# EAGLE design DAQ Module (EAGLE 9.5.1)
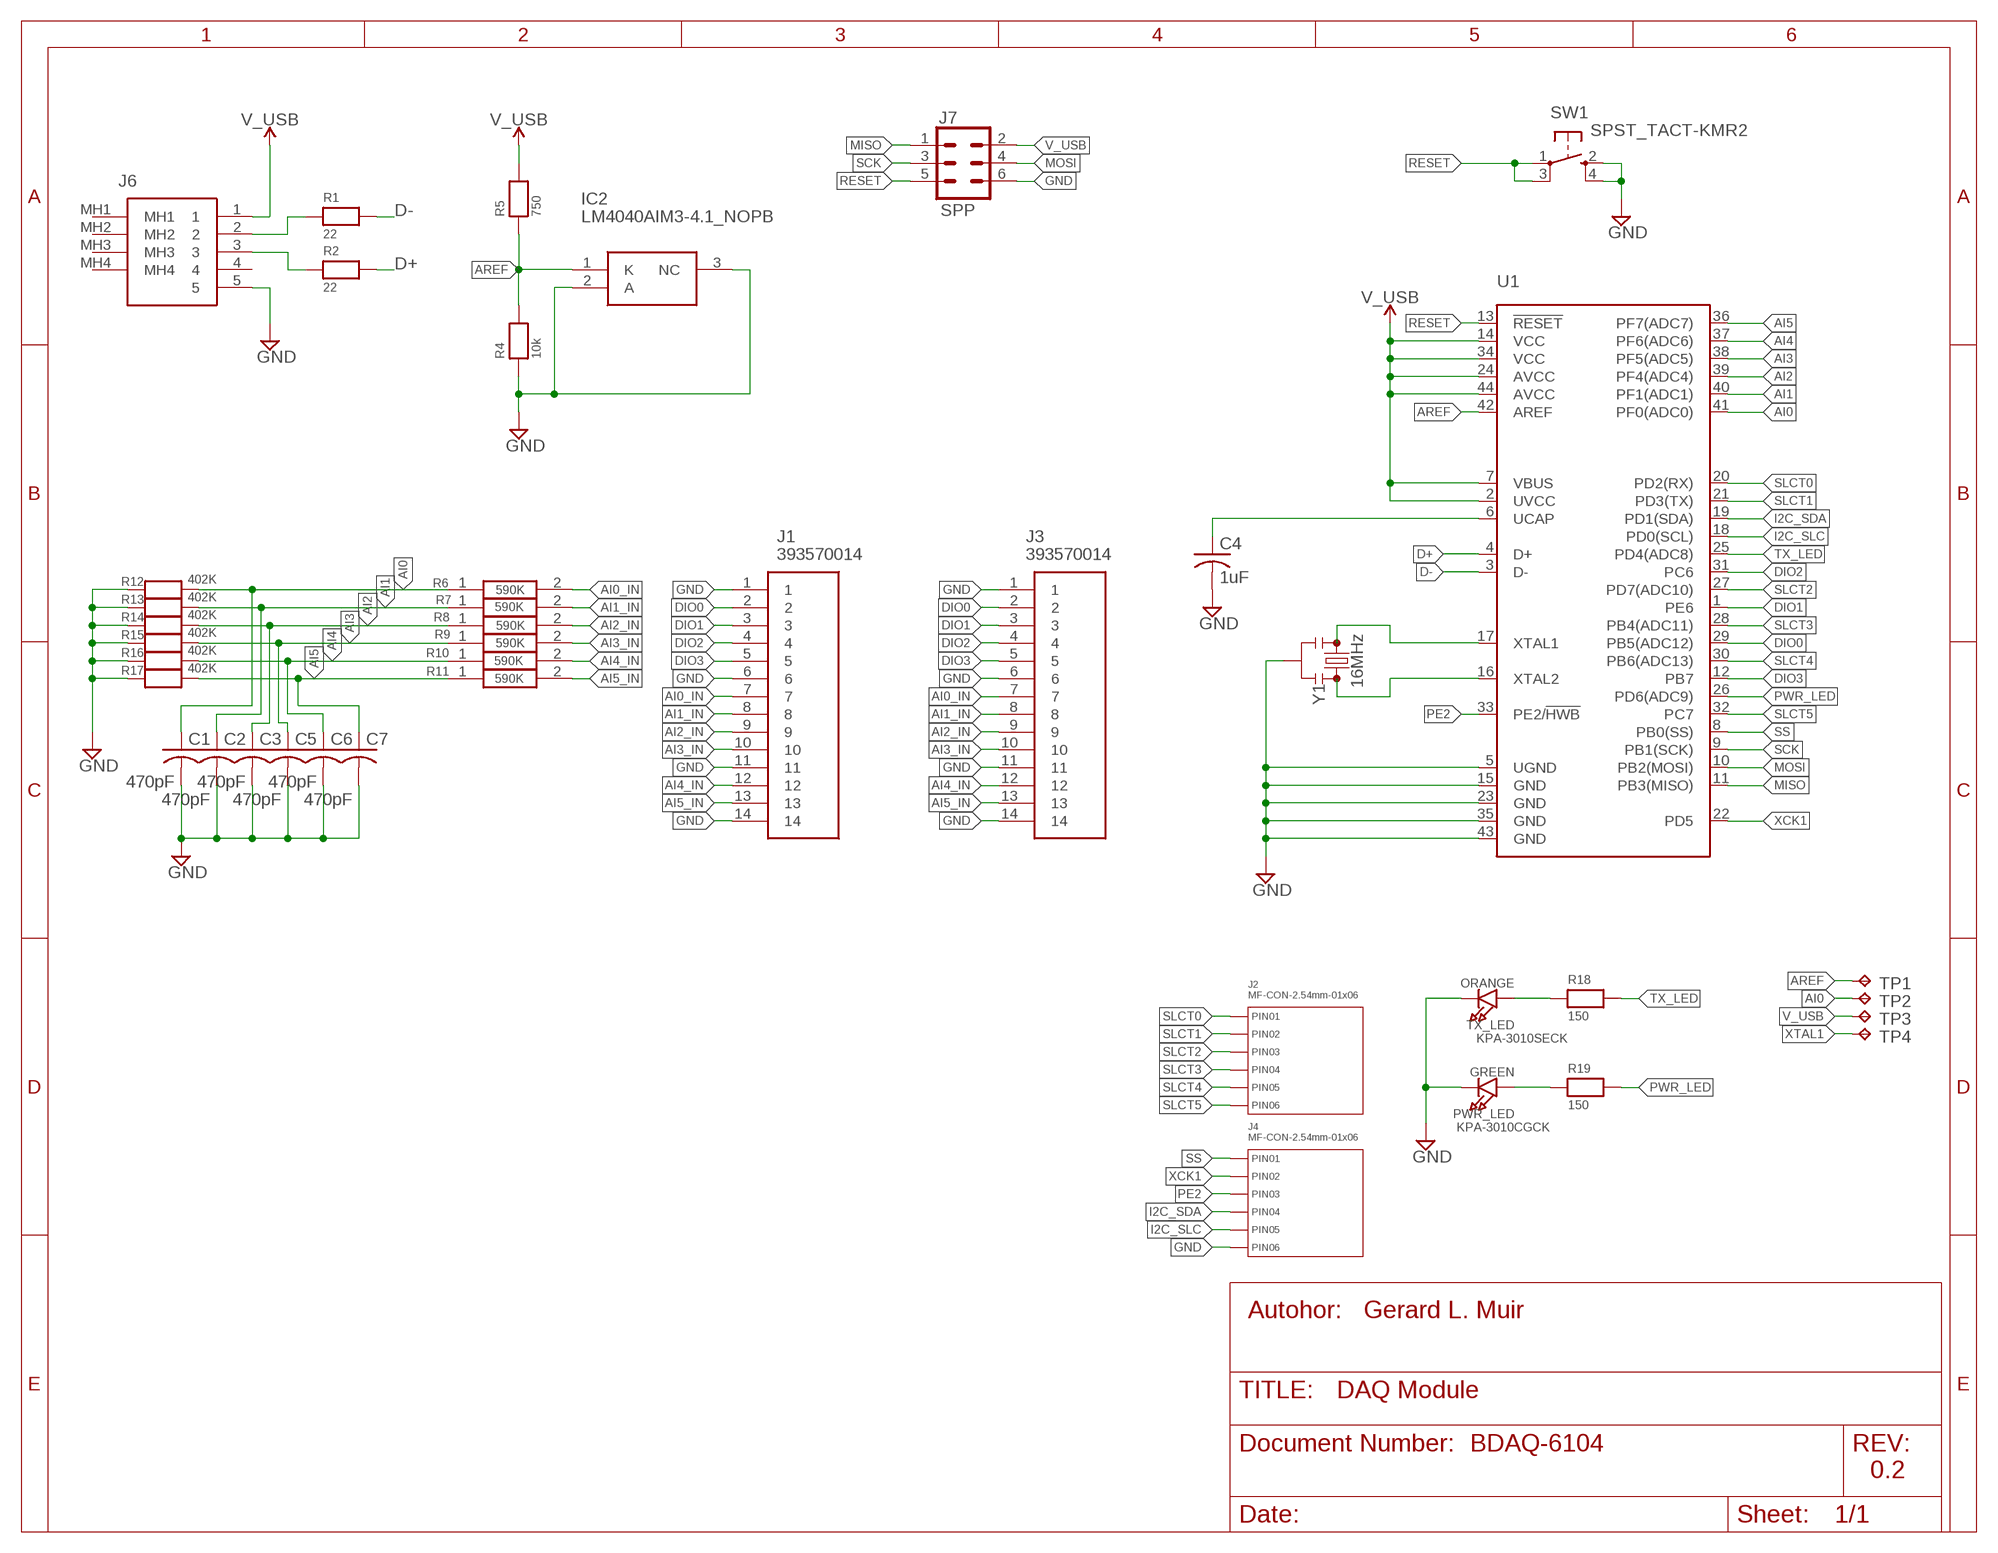
[diagram p0: schematic, sheet 1]

## Parts
C1  470pF  C-USC1206  [C1206]
C2  470pF  C-USC1206  [C1206]
C3  470pF  C-USC1206  [C1206]
C4  1uF  C-USC1206  [C1206]
C5  470pF  C-USC1206  [C1206]
C6  470pF  C-USC1206  [C1206]
C7  470pF  C-USC1206  [C1206]
IC2  LM4040AIM3-4.1_NOPB  [SOT95P237X112-3N]
J1  393570014  [RHDR16W90P0X350_1X14_5600X729X]
J2  MF-CON-2.54mm-01x06  CON_01X06_PTH_2.54MM  [PTH_2.54MM_01X06]
J3  393570014  [393570014X350_1X14]
J4  MF-CON-2.54mm-01x06  CON_01X06_PTH_2.54MM  [PTH_2.54MM_01X06]
J6  UJ2-MIBH2-4-SMT-TR  [UJ2MIBH24SMTTR]
J7  SPP  CONN_03X2FEMALE  [2X3]
PWR_LED  GREEN  LED1206  [CHIPLED_1206]
R1  22  RESISTOR1206  [1206]
R2  22  RESISTOR1206  [1206]
R4  10k  RESISTOR1206  [1206]
R5  750  RESISTOR1206  [1206]
R6  590K  ERJ3RED5903V  [RESC1608X55N]
R7  590K  ERJ3RED5903V  [RESC1608X55N]
R8  590K  ERJ3RED5903V  [RESC1608X55N]
R9  590K  ERJ3RED5903V  [RESC1608X55N]
R10  590K  ERJ3RED5903V  [RESC1608X55N]
R11  590K  ERJ3RED5903V  [RESC1608X55N]
R12  402K  RESISTOR1206  [1206]
R13  402K  RESISTOR1206  [1206]
R14  402K  RESISTOR1206  [1206]
R15  402K  RESISTOR1206  [1206]
R16  402K  RESISTOR1206  [1206]
R17  402K  RESISTOR1206  [1206]
R18  150  RESISTOR1206  [1206]
R19  150  RESISTOR1206  [1206]
SW1  SPST_TACT-KMR2  [KMR2]
TP1  TPB1,27  [B1,27]
TP2  TPB1,27  [B1,27]
TP3  TPB1,27  [B1,27]
TP4  TPB1,27  [B1,27]
TX_LED  ORANGE  LED1206  [CHIPLED_1206]
U1  ATMEGA32U4TQFP  [SPARKFUN-DIGITALIC_TQFP44]
Y1  16MHz  RESONATOR-16MHZSMD_3.2X1.3  [RESONATOR-SMD-3.2X1.3]

## Nets
AI0: C1.1 R6.1 R12.2 TP2.TP U1.41(PF0(ADC0))
AI0_IN: J1.7 J3.7 R6.2
AI1: C2.1 R7.1 R13.2 U1.40(PF1(ADC1))
AI1_IN: J1.8 J3.8 R7.2
AI2: C3.1 R8.1 R14.2 U1.39(PF4(ADC4))
AI2_IN: J1.9 J3.9 R8.2
AI3: C5.1 R9.1 R15.2 U1.38(PF5(ADC5))
AI3_IN: J1.10 J3.10 R9.2
AI4: C6.1 R10.1 R16.2 U1.37(PF6(ADC6))
AI4_IN: J1.12 J3.12 R10.2
AI5: C7.1 R11.1 R17.2 U1.36(PF7(ADC7))
AI5_IN: J1.13 J3.13 R11.2
AREF: IC2.1(K) R4.2 R5.1 TP1.TP U1.42(AREF)
D+: R2.2 U1.4(D+)
D-: R1.2 U1.3(D-)
DIO0: J1.2 J3.2 U1.29(PB5(ADC12))
DIO1: J1.3 J3.3 U1.1(PE6)
DIO2: J1.4 J3.4 U1.31(PC6)
DIO3: J1.5 J3.5 U1.12(PB7)
GND: C1.2 C2.2 C3.2 C4.2 C5.2 C6.2 C7.2 IC2.2(A) IC2.3(NC) J1.1 J1.6 J1.11 J1.14 J3.1 J3.6 J3.11 J3.14 J4.P$6(PIN6) J6.5 J7.6 PWR_LED.C R4.1 R12.1 R13.1 R14.1 R15.1 R16.1 R17.1 SW1.2(S) SW1.4(S1) TX_LED.C U1.5(UGND) U1.15(GND) U1.23(GND) U1.35(GND) U1.43(GND) Y1.2
I2C_SDA: J4.P$4(PIN4) U1.19(PD1(SDA))
I2C_SLC: J4.P$5(PIN5) U1.18(PD0(SCL))
MISO: J7.1 U1.11(PB3(MISO))
MOSI: J7.4 U1.10(PB2(MOSI))
N$2: J6.2 R1.1
N$5: J6.3 R2.1
N$7: C4.1 U1.6(UCAP)
N$8: R18.1 TX_LED.A
N$9: PWR_LED.A R19.1
PE2: J4.P$3(PIN3) U1.33(PE2/!HWB)
PWR_LED: R19.2 U1.26(PD6(ADC9))
RESET: J7.5 SW1.1(P) SW1.3(P1) U1.13(!RESET)
SCK: J7.3 U1.9(PB1(SCK))
SLCT0: J2.P$1(PIN1) U1.20(PD2(RX))
SLCT1: J2.P$2(PIN2) U1.21(PD3(TX))
SLCT2: J2.P$3(PIN3) U1.27(PD7(ADC10))
SLCT3: J2.P$4(PIN4) U1.28(PB4(ADC11))
SLCT4: J2.P$5(PIN5) U1.30(PB6(ADC13))
SLCT5: J2.P$6(PIN6) U1.32(PC7)
SS: J4.P$1(PIN1) U1.8(PB0(SS))
TX_LED: R18.2 U1.25(PD4(ADC8))
V_USB: J6.1 J7.2 R5.2 TP3.TP U1.2(UVCC) U1.7(VBUS) U1.14(VCC) U1.24(AVCC) U1.34(VCC) U1.44(AVCC)
XCK1: J4.P$2(PIN2) U1.22(PD5)
XTAL1: TP4.TP U1.17(XTAL1) Y1.3
XTAL2: U1.16(XTAL2) Y1.1
Unconnected: J6.4 J6.MH1 J6.MH2 J6.MH3 J6.MH4

## Notes on the sheet
- Autohor: | Gerard L. Muir
- BDAQ-6104
- 0.2

## Library data of the parts
C1-C3 C5-C7 = adafruit:C-US: CAPACITOR, American symbol; MANUFACTURER_NAME: KEMET; MANUFACTURER_PART: C1206C471J5GACTU; SUPPLIER: Newark; SUPPLIER_PART: 50AC8485
C4 = adafruit:C-US: CAPACITOR, American symbol; MANUFACTURER_NAME: TDK; MANUFACTURER_PART: C3216X7R1E105K085AACopied; SUPPLIER: NEWARK; SUPPLIER_PART: 90R7794
IC2 = LM4040AIM3-4.1_NOPB:LM4040AIM3-4.1_NOPB: 100-ppm/C precision micropower shunt voltage reference Source: Datasheet <https://datasheet.datasheetarchive.com/originals/distributors/Datasheets-DGA16/867642.pdf>; ARROW_PART_NUMBER: LM4040AIM3-4.1/NOPB; ARROW_PRICE-STOCK: https://www.arrow.com/en/products/lm4040aim3-4.1nopb/texas-instruments?region=nac; DESCRIPTION: 100-ppm/C precision micropower shunt voltage reference; HEIGHT: 1.12mm; MANUFACTURER_NAME: Texas Instruments; MANUFACTURER_PART_NUMBER: LM4040AIM3-4.1/NOPB; MOUSER_PART_NUMBER: 926-LM4040AIM341NOPB; MOUSER_PRICE-STOCK: https://www.mouser.co.uk/ProductDetail/Texas-Instruments/LM4040AIM3-4.1-NOPB?qs=QbsRYf82W3H1qYso%252BTC8AA%3D%3D
J1 = 393570014:393570014: 3.50mm Pitch Beau Eurostyle Fixed Mount PCB Terminal Block, Circuits Source: Datasheet <https://www.molex.com/pdm_docs/sd/393570005_sd.pdf>; DESCRIPTION: 3.50mm Pitch Beau Eurostyle Fixed Mount PCB Terminal Block, Circuits; HEIGHT: 8.51mm; MANUFACTURER_NAME: Molex; MANUFACTURER_PART_NUMBER: 393570016
J2 J4 = MF_Connectors:CON_01X06: Library: MF_Connectors Description: Header Connector with 6 Positions and 01 Rows. Use the LABEL Attribute to label the pin on the schematic and PCB. You can remove the attributes on the PCB by using the SMASH function on the part and then deleting the text.; HOUSEPART: YES; MPN: MF-CON-2.54mm-01x06; POPULATE: 1; URL: https://factory.macrofab.com/part/MF-CON-2.54mm-01x06
J3 = 3950666014:393570014: 3.50mm Pitch Beau Eurostyle Fixed Mount PCB Terminal Block, Circuits Source: Datasheet <https://www.molex.com/pdm_docs/sd/393570005_sd.pdf>; DESCRIPTION: 3.50mm Pitch Beau Eurostyle Fixed Mount PCB Terminal Block, Circuits; HEIGHT: 8.51mm; MANUFACTURER_NAME: Molex; MANUFACTURER_PART_NUMBER: 393570016
J6 = UJ2-MIBH2-4-SMT-TR:UJ2-MIBH2-4-SMT-TR: CONN RCPT USB2.0 MICRO B SMD R/A Source: Datasheet <https://www.cui.com/product/resource/digikeypdf/uj2-mibh2-4-smt.pdf>; ARROW_PART_NUMBER: UJ2-MIBH2-4-SMT-TR; ARROW_PRICE-STOCK: https://www.arrow.com/en/products/uj2-mibh2-4-smt-tr/cui-devices?utm_currency=USD&region=nac; DESCRIPTION: CONN RCPT USB2.0 MICRO B SMD R/A; HEIGHT: 2.5mm; MANUFACTURER_NAME: Same Sky; MANUFACTURER_PART_NUMBER: UJ2-MIBH2-4-SMT-TR; MOUSER_PART_NUMBER: 490-UJ2-MIBH2-4-SMT; MOUSER_PRICE-STOCK: https://www.mouser.co.uk/ProductDetail/Same-Sky/UJ2-MIBH2-4-SMT-TR?qs=5mqXD9RfOg1yxHIpPvPxvQ%3D%3D
J7 = SparkFun-Connectors:CONN_03X2: Multi connection point. Often used as Generic Header-pin footprint for 0.1 inch spaced/style header connections You can populate with any combo of single row headers, but if you'd like an exact match, check these: Header - 2x3 (Male, 0.1") <https://www.sparkfun.com/products/12807> (PRT-12807) Header - 2x3 (Female, 0.1") <https://www.sparkfun.com/products/13010> (PRT-13010) 2x3 Pin Shrouded Header <https://www.sparkfun.com/products/10877> (PRT-10877) On any of the 0.1 inch spaced packages, you can populate with these: Break Away Headers - Straight <https://www.sparkfun.com/products/116> (PRT-00116) Break Away Male Headers - Right Angle <https://www.sparkfun.com/products/553> (PRT-00553) Female Headers <https://www.sparkfun.com/products/115> (PRT-00115) Break Away Headers - Machine Pin <https://www.sparkfun.com/products/117> (PRT-00117) Break Away Female Headers - Swiss Machine Pin <https://www.sparkfun.com/products/743> (PRT-00743) Special note: the shrouded connector mates well with our 3x2 ribbon cables: Ribbon Crimp Connector - 6-pin (2x3, Female) <https://www.sparkfun.com/products/10651> (PRT-10651) Ribbon Cable - 6 wire (15ft) <https://www.sparkfun.com/products/10646> (PRT-10646); PROD_ID: CONN-11566; VALUE: FEMALE 2x3
PWR_LED = microbuilder:LED: LED 0603 - 0603 Surface Mount Package 2mA: Green LED - Low Power (3.9mcd, 2ma, 1.7Vf) - Digikey: 475-2709-2-ND Orange LED - Low Power (9.8mcd, 2ma, 1.8Vf) - Digikey: 475-1194-2-ND Red LED - Low Power (5mcd, 2ma, 1.8Vf) - Digikey: 475-1195-2-ND Yellow LED - Low Power (7mcd, 2ma, 1.8Vf) - Digikey: 475-1196-2-ND 5mA: Blue LED - Low Power (17mcd, 5ma, 2.9Vf) - Digikey: LNJ937W8CRACT-ND 0805 - 0805 Surface Mount Package 2mA: Red LED (8.8mcd, 2mA, 1.8Vf, Clear) - Low Power [Digikey: 475-2510-1-ND] Green LED (5mcd, 2mA, 1.8Vf, Clear) - Low Power [Digikey: 475-2730-1-ND] Yellow LED (11.3mcd, 2mA, 1.8Vf, Clear) - Low Power [Digikey: 475-2555-1-ND] 20mA: Red LED (104mcd, 20mA, Diffused) - LS R976 [Digikey: 475-1278-6-ND] Red LED (12mcd, 20mA, 2.0Vf, Clear) - APT2012EC [Digikey: 754-1128-1-ND] Green LED (15mcd, 20mA, 2.2Vf, Clear) - APT2012GC [Digikey: 754-1131-1-ND] Orange LED (160mcd, 20mA, 2.1Vf, Clear) - APT2012SECK [Digikey: 754-1130-1-ND] 1206 - 1206 Surface Mount Package Green LED (26mcd, 20mA, Diffused) - LG N971 [Digikey: 475-1407-6-ND] Red LED (15mcd, 20mA, Diffused) - LH N974 [Digikey: 475-1416-6-ND]; MANUFACTURER_NAME: KINGBRIGHT; MANUFACTURER_PART: KPA-3010CGCK; SUPPLIER: Newark; SUPPLIER_PART: 28W1828
R1 = microbuilder:RESISTOR: Resistors 0402 - 0402 Surface Mount Package 22 Ohm 1% 1/16W [Digikey: 311-22.0LRTR-ND] 33 Ohm 5% 1/16W 1.0K 5% 1/16W 1.5K 5% 1/16W 2.0K 1% 1/16W 10.0K 1% 1/16W [Digikey: 311-10.0KLRTR-ND] 10.0K 5% 1/16W [Digikey: RMCF0402JT10K0TR-ND] 12.1K 1% 1/16W [Digikey: 311-22.0LRTR-ND] 100.0K 5% 1/16W 0603 - 0603 Surface Mount Package 0 Ohm 1/10 Watt 1% Resistor 15 Ohm 1/10 Watt 1% Resistor 33 Ohm 1/10 Watt 1% Resistor 49.9 Ohm 1/10 Watt 1% Resistor 100 Ohm 1/10 Watt 1% Resistor 150 Ohm 1/10 Watt 1% Resistor 240 Ohm 1/10 Watt 1% Resistor 390 Ohm 1/10 Watt 1% Resistor 560 Ohm 1/10 Watt 1% Resistor 680 Ohm 1/10 Watt 1% Resistor 750 Ohm 1/10 Watt 1% Resistor 1.0K Ohm 1/10 Watt 1% Resistor 1.5K Ohm 1/10 Watt 1% Resistor 2.0K Ohm 1/10 Watt 1% Resistor 2.2K Ohm 1/10 Watt 1% Resistor 3.3K Ohm 1/10 Watt 1% Resistor 4.7K Ohm 1/10 Watt 1% Resistor 10.0K Ohm 1/10 Watt 1% Resistor 12.0K Ohm 1/10 Watt 1% Resistor 12.1K Ohm 1/10 Watt 1% Resistor 20.0K Ohm 1/10 Watt 1% Resistor 33.0K Ohm 1/10 Watt 1% Resistor 100.0K Ohm 1/10 Watt 1% Resistor 0805 - 0805 Surface Mount Package 0 Ohm 1/8 Watt 1% Resistor 33 Ohm 1/8 Watt 1% Resistor 100 Ohm 1/8 Watt 1% Resistor 150 Ohm 1/8 Watt 1% Resistor 200 Ohm 1/8 Watt 1% Resistor 240 Ohm 1/8 Watt 1% Resistor 330 Ohm 1/8 Watt 1% Resistor 390 Ohm 1/8 Watt 1% Resistor 470 Ohm 1/8 Watt 1% Resistor 1.0K Ohm 1/8 Watt 1% Resistor 1.5K Ohm 1/8 Watt 1% Resistor 2.0K Ohm 1/8 Watt 1% Resistor 4.7K Ohm 1/8 Watt 1% Resistor 5.1K Ohm 1/8 Watt 1% Resistor 5.6K Ohm 1/8 Watt 1% Resistor 10.0K Ohm 1/8 Watt 1% Resistor 22.0K Ohm 1/8 Watt 1% Resistor 33.0K Ohm 1/8 Watt 1% Resistor 100K Ohm 1/8 Watt 1% Resistor 1206 - 1206 Surface Mount Package 2012 - 2010 Surface Mount Package 0.11 Ohm 1/2 Watt 1% Resistor - Digikey: RHM.11UCT-ND; MANUFACTURER_NAME: PANASONIC; MANUFACTURER_PART: ERJ8ENF22R0V; SUPPLIER: NEWARK; SUPPLIER_PART: 64R5449
R2 R19 = microbuilder:RESISTOR: Resistors 0402 - 0402 Surface Mount Package 22 Ohm 1% 1/16W [Digikey: 311-22.0LRTR-ND] 33 Ohm 5% 1/16W 1.0K 5% 1/16W 1.5K 5% 1/16W 2.0K 1% 1/16W 10.0K 1% 1/16W [Digikey: 311-10.0KLRTR-ND] 10.0K 5% 1/16W [Digikey: RMCF0402JT10K0TR-ND] 12.1K 1% 1/16W [Digikey: 311-22.0LRTR-ND] 100.0K 5% 1/16W 0603 - 0603 Surface Mount Package 0 Ohm 1/10 Watt 1% Resistor 15 Ohm 1/10 Watt 1% Resistor 33 Ohm 1/10 Watt 1% Resistor 49.9 Ohm 1/10 Watt 1% Resistor 100 Ohm 1/10 Watt 1% Resistor 150 Ohm 1/10 Watt 1% Resistor 240 Ohm 1/10 Watt 1% Resistor 390 Ohm 1/10 Watt 1% Resistor 560 Ohm 1/10 Watt 1% Resistor 680 Ohm 1/10 Watt 1% Resistor 750 Ohm 1/10 Watt 1% Resistor 1.0K Ohm 1/10 Watt 1% Resistor 1.5K Ohm 1/10 Watt 1% Resistor 2.0K Ohm 1/10 Watt 1% Resistor 2.2K Ohm 1/10 Watt 1% Resistor 3.3K Ohm 1/10 Watt 1% Resistor 4.7K Ohm 1/10 Watt 1% Resistor 10.0K Ohm 1/10 Watt 1% Resistor 12.0K Ohm 1/10 Watt 1% Resistor 12.1K Ohm 1/10 Watt 1% Resistor 20.0K Ohm 1/10 Watt 1% Resistor 33.0K Ohm 1/10 Watt 1% Resistor 100.0K Ohm 1/10 Watt 1% Resistor 0805 - 0805 Surface Mount Package 0 Ohm 1/8 Watt 1% Resistor 33 Ohm 1/8 Watt 1% Resistor 100 Ohm 1/8 Watt 1% Resistor 150 Ohm 1/8 Watt 1% Resistor 200 Ohm 1/8 Watt 1% Resistor 240 Ohm 1/8 Watt 1% Resistor 330 Ohm 1/8 Watt 1% Resistor 390 Ohm 1/8 Watt 1% Resistor 470 Ohm 1/8 Watt 1% Resistor 1.0K Ohm 1/8 Watt 1% Resistor 1.5K Ohm 1/8 Watt 1% Resistor 2.0K Ohm 1/8 Watt 1% Resistor 4.7K Ohm 1/8 Watt 1% Resistor 5.1K Ohm 1/8 Watt 1% Resistor 5.6K Ohm 1/8 Watt 1% Resistor 10.0K Ohm 1/8 Watt 1% Resistor 22.0K Ohm 1/8 Watt 1% Resistor 33.0K Ohm 1/8 Watt 1% Resistor 100K Ohm 1/8 Watt 1% Resistor 1206 - 1206 Surface Mount Package 2012 - 2010 Surface Mount Package 0.11 Ohm 1/2 Watt 1% Resistor - Digikey: RHM.11UCT-ND
R4 = microbuilder:RESISTOR: Resistors 0402 - 0402 Surface Mount Package 22 Ohm 1% 1/16W [Digikey: 311-22.0LRTR-ND] 33 Ohm 5% 1/16W 1.0K 5% 1/16W 1.5K 5% 1/16W 2.0K 1% 1/16W 10.0K 1% 1/16W [Digikey: 311-10.0KLRTR-ND] 10.0K 5% 1/16W [Digikey: RMCF0402JT10K0TR-ND] 12.1K 1% 1/16W [Digikey: 311-22.0LRTR-ND] 100.0K 5% 1/16W 0603 - 0603 Surface Mount Package 0 Ohm 1/10 Watt 1% Resistor 15 Ohm 1/10 Watt 1% Resistor 33 Ohm 1/10 Watt 1% Resistor 49.9 Ohm 1/10 Watt 1% Resistor 100 Ohm 1/10 Watt 1% Resistor 150 Ohm 1/10 Watt 1% Resistor 240 Ohm 1/10 Watt 1% Resistor 390 Ohm 1/10 Watt 1% Resistor 560 Ohm 1/10 Watt 1% Resistor 680 Ohm 1/10 Watt 1% Resistor 750 Ohm 1/10 Watt 1% Resistor 1.0K Ohm 1/10 Watt 1% Resistor 1.5K Ohm 1/10 Watt 1% Resistor 2.0K Ohm 1/10 Watt 1% Resistor 2.2K Ohm 1/10 Watt 1% Resistor 3.3K Ohm 1/10 Watt 1% Resistor 4.7K Ohm 1/10 Watt 1% Resistor 10.0K Ohm 1/10 Watt 1% Resistor 12.0K Ohm 1/10 Watt 1% Resistor 12.1K Ohm 1/10 Watt 1% Resistor 20.0K Ohm 1/10 Watt 1% Resistor 33.0K Ohm 1/10 Watt 1% Resistor 100.0K Ohm 1/10 Watt 1% Resistor 0805 - 0805 Surface Mount Package 0 Ohm 1/8 Watt 1% Resistor 33 Ohm 1/8 Watt 1% Resistor 100 Ohm 1/8 Watt 1% Resistor 150 Ohm 1/8 Watt 1% Resistor 200 Ohm 1/8 Watt 1% Resistor 240 Ohm 1/8 Watt 1% Resistor 330 Ohm 1/8 Watt 1% Resistor 390 Ohm 1/8 Watt 1% Resistor 470 Ohm 1/8 Watt 1% Resistor 1.0K Ohm 1/8 Watt 1% Resistor 1.5K Ohm 1/8 Watt 1% Resistor 2.0K Ohm 1/8 Watt 1% Resistor 4.7K Ohm 1/8 Watt 1% Resistor 5.1K Ohm 1/8 Watt 1% Resistor 5.6K Ohm 1/8 Watt 1% Resistor 10.0K Ohm 1/8 Watt 1% Resistor 22.0K Ohm 1/8 Watt 1% Resistor 33.0K Ohm 1/8 Watt 1% Resistor 100K Ohm 1/8 Watt 1% Resistor 1206 - 1206 Surface Mount Package 2012 - 2010 Surface Mount Package 0.11 Ohm 1/2 Watt 1% Resistor - Digikey: RHM.11UCT-ND; MANUFACTURER_NAME: YAGEO; MANUFACTURER_PART: RP1206BRD075K1L; SUPPLIER: NEWARK
R5 = microbuilder:RESISTOR: Resistors 0402 - 0402 Surface Mount Package 22 Ohm 1% 1/16W [Digikey: 311-22.0LRTR-ND] 33 Ohm 5% 1/16W 1.0K 5% 1/16W 1.5K 5% 1/16W 2.0K 1% 1/16W 10.0K 1% 1/16W [Digikey: 311-10.0KLRTR-ND] 10.0K 5% 1/16W [Digikey: RMCF0402JT10K0TR-ND] 12.1K 1% 1/16W [Digikey: 311-22.0LRTR-ND] 100.0K 5% 1/16W 0603 - 0603 Surface Mount Package 0 Ohm 1/10 Watt 1% Resistor 15 Ohm 1/10 Watt 1% Resistor 33 Ohm 1/10 Watt 1% Resistor 49.9 Ohm 1/10 Watt 1% Resistor 100 Ohm 1/10 Watt 1% Resistor 150 Ohm 1/10 Watt 1% Resistor 240 Ohm 1/10 Watt 1% Resistor 390 Ohm 1/10 Watt 1% Resistor 560 Ohm 1/10 Watt 1% Resistor 680 Ohm 1/10 Watt 1% Resistor 750 Ohm 1/10 Watt 1% Resistor 1.0K Ohm 1/10 Watt 1% Resistor 1.5K Ohm 1/10 Watt 1% Resistor 2.0K Ohm 1/10 Watt 1% Resistor 2.2K Ohm 1/10 Watt 1% Resistor 3.3K Ohm 1/10 Watt 1% Resistor 4.7K Ohm 1/10 Watt 1% Resistor 10.0K Ohm 1/10 Watt 1% Resistor 12.0K Ohm 1/10 Watt 1% Resistor 12.1K Ohm 1/10 Watt 1% Resistor 20.0K Ohm 1/10 Watt 1% Resistor 33.0K Ohm 1/10 Watt 1% Resistor 100.0K Ohm 1/10 Watt 1% Resistor 0805 - 0805 Surface Mount Package 0 Ohm 1/8 Watt 1% Resistor 33 Ohm 1/8 Watt 1% Resistor 100 Ohm 1/8 Watt 1% Resistor 150 Ohm 1/8 Watt 1% Resistor 200 Ohm 1/8 Watt 1% Resistor 240 Ohm 1/8 Watt 1% Resistor 330 Ohm 1/8 Watt 1% Resistor 390 Ohm 1/8 Watt 1% Resistor 470 Ohm 1/8 Watt 1% Resistor 1.0K Ohm 1/8 Watt 1% Resistor 1.5K Ohm 1/8 Watt 1% Resistor 2.0K Ohm 1/8 Watt 1% Resistor 4.7K Ohm 1/8 Watt 1% Resistor 5.1K Ohm 1/8 Watt 1% Resistor 5.6K Ohm 1/8 Watt 1% Resistor 10.0K Ohm 1/8 Watt 1% Resistor 22.0K Ohm 1/8 Watt 1% Resistor 33.0K Ohm 1/8 Watt 1% Resistor 100K Ohm 1/8 Watt 1% Resistor 1206 - 1206 Surface Mount Package 2012 - 2010 Surface Mount Package 0.11 Ohm 1/2 Watt 1% Resistor - Digikey: RHM.11UCT-ND; MANUFACTURER_NAME: MULTICOMP PRO; MANUFACTURER_PART: MC009121; SUPPLIER: NEWARK; SUPPLIE_PART: 78AC9440
R6-R11 = ERJ3RED5903V:ERJ3RED5903V: PANASONIC - ERJ3RED5903V - SMD Chip Resistor, 0603 [1608 Metric], 590 kohm, ERJ3R Series, 50 V, Thick Film, 63 mW Source: Datasheet <http://docs-europe.electrocomponents.com/webdocs/13ba/0900766b813ba21b.pdf>; DESCRIPTION: PANASONIC - ERJ3RED5903V - SMD Chip Resistor, 0603 [1608 Metric], 590 kohm, ERJ3R Series, 50 V, Thick Film, 63 mW; HEIGHT: 0.55mm; MANUFACTURER_NAME: Stackpole Electronics Inc; MANUFACTURER_PART: RNCS1206BKE1M00; MANUFACTURER_PART_NUMBER: ERJ3RED5903V; SUPPLIER: NEWARK; SUPPLIER_PART: RNCS1206BKE1M00TR-ND
R12-R17 = microbuilder:RESISTOR: Resistors 0402 - 0402 Surface Mount Package 22 Ohm 1% 1/16W [Digikey: 311-22.0LRTR-ND] 33 Ohm 5% 1/16W 1.0K 5% 1/16W 1.5K 5% 1/16W 2.0K 1% 1/16W 10.0K 1% 1/16W [Digikey: 311-10.0KLRTR-ND] 10.0K 5% 1/16W [Digikey: RMCF0402JT10K0TR-ND] 12.1K 1% 1/16W [Digikey: 311-22.0LRTR-ND] 100.0K 5% 1/16W 0603 - 0603 Surface Mount Package 0 Ohm 1/10 Watt 1% Resistor 15 Ohm 1/10 Watt 1% Resistor 33 Ohm 1/10 Watt 1% Resistor 49.9 Ohm 1/10 Watt 1% Resistor 100 Ohm 1/10 Watt 1% Resistor 150 Ohm 1/10 Watt 1% Resistor 240 Ohm 1/10 Watt 1% Resistor 390 Ohm 1/10 Watt 1% Resistor 560 Ohm 1/10 Watt 1% Resistor 680 Ohm 1/10 Watt 1% Resistor 750 Ohm 1/10 Watt 1% Resistor 1.0K Ohm 1/10 Watt 1% Resistor 1.5K Ohm 1/10 Watt 1% Resistor 2.0K Ohm 1/10 Watt 1% Resistor 2.2K Ohm 1/10 Watt 1% Resistor 3.3K Ohm 1/10 Watt 1% Resistor 4.7K Ohm 1/10 Watt 1% Resistor 10.0K Ohm 1/10 Watt 1% Resistor 12.0K Ohm 1/10 Watt 1% Resistor 12.1K Ohm 1/10 Watt 1% Resistor 20.0K Ohm 1/10 Watt 1% Resistor 33.0K Ohm 1/10 Watt 1% Resistor 100.0K Ohm 1/10 Watt 1% Resistor 0805 - 0805 Surface Mount Package 0 Ohm 1/8 Watt 1% Resistor 33 Ohm 1/8 Watt 1% Resistor 100 Ohm 1/8 Watt 1% Resistor 150 Ohm 1/8 Watt 1% Resistor 200 Ohm 1/8 Watt 1% Resistor 240 Ohm 1/8 Watt 1% Resistor 330 Ohm 1/8 Watt 1% Resistor 390 Ohm 1/8 Watt 1% Resistor 470 Ohm 1/8 Watt 1% Resistor 1.0K Ohm 1/8 Watt 1% Resistor 1.5K Ohm 1/8 Watt 1% Resistor 2.0K Ohm 1/8 Watt 1% Resistor 4.7K Ohm 1/8 Watt 1% Resistor 5.1K Ohm 1/8 Watt 1% Resistor 5.6K Ohm 1/8 Watt 1% Resistor 10.0K Ohm 1/8 Watt 1% Resistor 22.0K Ohm 1/8 Watt 1% Resistor 33.0K Ohm 1/8 Watt 1% Resistor 100K Ohm 1/8 Watt 1% Resistor 1206 - 1206 Surface Mount Package 2012 - 2010 Surface Mount Package 0.11 Ohm 1/2 Watt 1% Resistor - Digikey: RHM.11UCT-ND; MANUFACTURER_NAME: MULTICOMP PRO; MANUFACTURER_PART: MCWF12R4023BTL; SUPPLIER: NEWARK; SUPPLIER_PART: 92AH9453
R18 = microbuilder:RESISTOR: Resistors 0402 - 0402 Surface Mount Package 22 Ohm 1% 1/16W [Digikey: 311-22.0LRTR-ND] 33 Ohm 5% 1/16W 1.0K 5% 1/16W 1.5K 5% 1/16W 2.0K 1% 1/16W 10.0K 1% 1/16W [Digikey: 311-10.0KLRTR-ND] 10.0K 5% 1/16W [Digikey: RMCF0402JT10K0TR-ND] 12.1K 1% 1/16W [Digikey: 311-22.0LRTR-ND] 100.0K 5% 1/16W 0603 - 0603 Surface Mount Package 0 Ohm 1/10 Watt 1% Resistor 15 Ohm 1/10 Watt 1% Resistor 33 Ohm 1/10 Watt 1% Resistor 49.9 Ohm 1/10 Watt 1% Resistor 100 Ohm 1/10 Watt 1% Resistor 150 Ohm 1/10 Watt 1% Resistor 240 Ohm 1/10 Watt 1% Resistor 390 Ohm 1/10 Watt 1% Resistor 560 Ohm 1/10 Watt 1% Resistor 680 Ohm 1/10 Watt 1% Resistor 750 Ohm 1/10 Watt 1% Resistor 1.0K Ohm 1/10 Watt 1% Resistor 1.5K Ohm 1/10 Watt 1% Resistor 2.0K Ohm 1/10 Watt 1% Resistor 2.2K Ohm 1/10 Watt 1% Resistor 3.3K Ohm 1/10 Watt 1% Resistor 4.7K Ohm 1/10 Watt 1% Resistor 10.0K Ohm 1/10 Watt 1% Resistor 12.0K Ohm 1/10 Watt 1% Resistor 12.1K Ohm 1/10 Watt 1% Resistor 20.0K Ohm 1/10 Watt 1% Resistor 33.0K Ohm 1/10 Watt 1% Resistor 100.0K Ohm 1/10 Watt 1% Resistor 0805 - 0805 Surface Mount Package 0 Ohm 1/8 Watt 1% Resistor 33 Ohm 1/8 Watt 1% Resistor 100 Ohm 1/8 Watt 1% Resistor 150 Ohm 1/8 Watt 1% Resistor 200 Ohm 1/8 Watt 1% Resistor 240 Ohm 1/8 Watt 1% Resistor 330 Ohm 1/8 Watt 1% Resistor 390 Ohm 1/8 Watt 1% Resistor 470 Ohm 1/8 Watt 1% Resistor 1.0K Ohm 1/8 Watt 1% Resistor 1.5K Ohm 1/8 Watt 1% Resistor 2.0K Ohm 1/8 Watt 1% Resistor 4.7K Ohm 1/8 Watt 1% Resistor 5.1K Ohm 1/8 Watt 1% Resistor 5.6K Ohm 1/8 Watt 1% Resistor 10.0K Ohm 1/8 Watt 1% Resistor 22.0K Ohm 1/8 Watt 1% Resistor 33.0K Ohm 1/8 Watt 1% Resistor 100K Ohm 1/8 Watt 1% Resistor 1206 - 1206 Surface Mount Package 2012 - 2010 Surface Mount Package 0.11 Ohm 1/2 Watt 1% Resistor - Digikey: RHM.11UCT-ND; MANUFACTURER_NAME: VISHAY; MANUFACTURER_PART: CRCW1206150RFKEA; SUPPLIER: NEWARK; SUPPLIER_PART: 42K4824
SW1 = adafruit:SPST_TACT: SMT 6mm switch, EVQQ2 series http://www.ladyada.net/library/eagle; MANUFACTURER_NAME: C&K COMPONENTS; MANUFACTURER_PART: KMR221G LFS; SUPPLIER_NAME: NEWARK; SUPPLIER_PART: 35AH0914Copied
TP1-TP4 = testpad:TP: Test pad
TX_LED = microbuilder:LED: LED 0603 - 0603 Surface Mount Package 2mA: Green LED - Low Power (3.9mcd, 2ma, 1.7Vf) - Digikey: 475-2709-2-ND Orange LED - Low Power (9.8mcd, 2ma, 1.8Vf) - Digikey: 475-1194-2-ND Red LED - Low Power (5mcd, 2ma, 1.8Vf) - Digikey: 475-1195-2-ND Yellow LED - Low Power (7mcd, 2ma, 1.8Vf) - Digikey: 475-1196-2-ND 5mA: Blue LED - Low Power (17mcd, 5ma, 2.9Vf) - Digikey: LNJ937W8CRACT-ND 0805 - 0805 Surface Mount Package 2mA: Red LED (8.8mcd, 2mA, 1.8Vf, Clear) - Low Power [Digikey: 475-2510-1-ND] Green LED (5mcd, 2mA, 1.8Vf, Clear) - Low Power [Digikey: 475-2730-1-ND] Yellow LED (11.3mcd, 2mA, 1.8Vf, Clear) - Low Power [Digikey: 475-2555-1-ND] 20mA: Red LED (104mcd, 20mA, Diffused) - LS R976 [Digikey: 475-1278-6-ND] Red LED (12mcd, 20mA, 2.0Vf, Clear) - APT2012EC [Digikey: 754-1128-1-ND] Green LED (15mcd, 20mA, 2.2Vf, Clear) - APT2012GC [Digikey: 754-1131-1-ND] Orange LED (160mcd, 20mA, 2.1Vf, Clear) - APT2012SECK [Digikey: 754-1130-1-ND] 1206 - 1206 Surface Mount Package Green LED (26mcd, 20mA, Diffused) - LG N971 [Digikey: 475-1407-6-ND] Red LED (15mcd, 20mA, Diffused) - LH N974 [Digikey: 475-1416-6-ND]; MANUFACTURER_NAME: KINGBRIGHT; MANUFACTURER_PART: KPA-3010SECK; SUPPLIER: Newark; SUPPLIE_PART: 28W1830
U1 = SparkFun-Retired:ATMEGA32U4: Atmel 44-pin 8-bit Microcontroller with 32KBytes of ISP Flash and USB Controller ----- Please use the QFN-44-NOPAD_1:1 package for the footprint of all boards using a 32U4. Route traces directly away from the pads as much as possible.; MANUFACTURER_NAME: MICROCHIP; MANUFACTURER_PART: ATMEGA32U4-AU; PROD_ID: IC-11161; SUPPLIER: NEWARK; SUPPLIER_PART: 68T2838
Y1 = SparkFun-Clocks:RESONATOR-16MHZ: 16MHz Resonator Digikey Example <http://www.digikey.com/product-detail/en/murata-electronics-north-america/CSTCE16M0V53-R0/490-1198-1-ND/584635> Frequency: 16MHz Frequency Stability: ±0.3% Frequency Tolerance: ±0.5% Capacitance: 15pF SparkFun Products SparkFun OpenLog <https://www.sparkfun.com/products/13712> SparkFun MicroView - OLED Arduino Module <https://www.sparkfun.com/products/12923>; MANUFACTURER_NAME: MURATA; MANUFACTURER_PART: CSTNE16M0V530000R0; PROD_ID: XTAL-08900; SUPPLIER: NEWARK; SUPPLIE_PART: 62AK5105

## Board
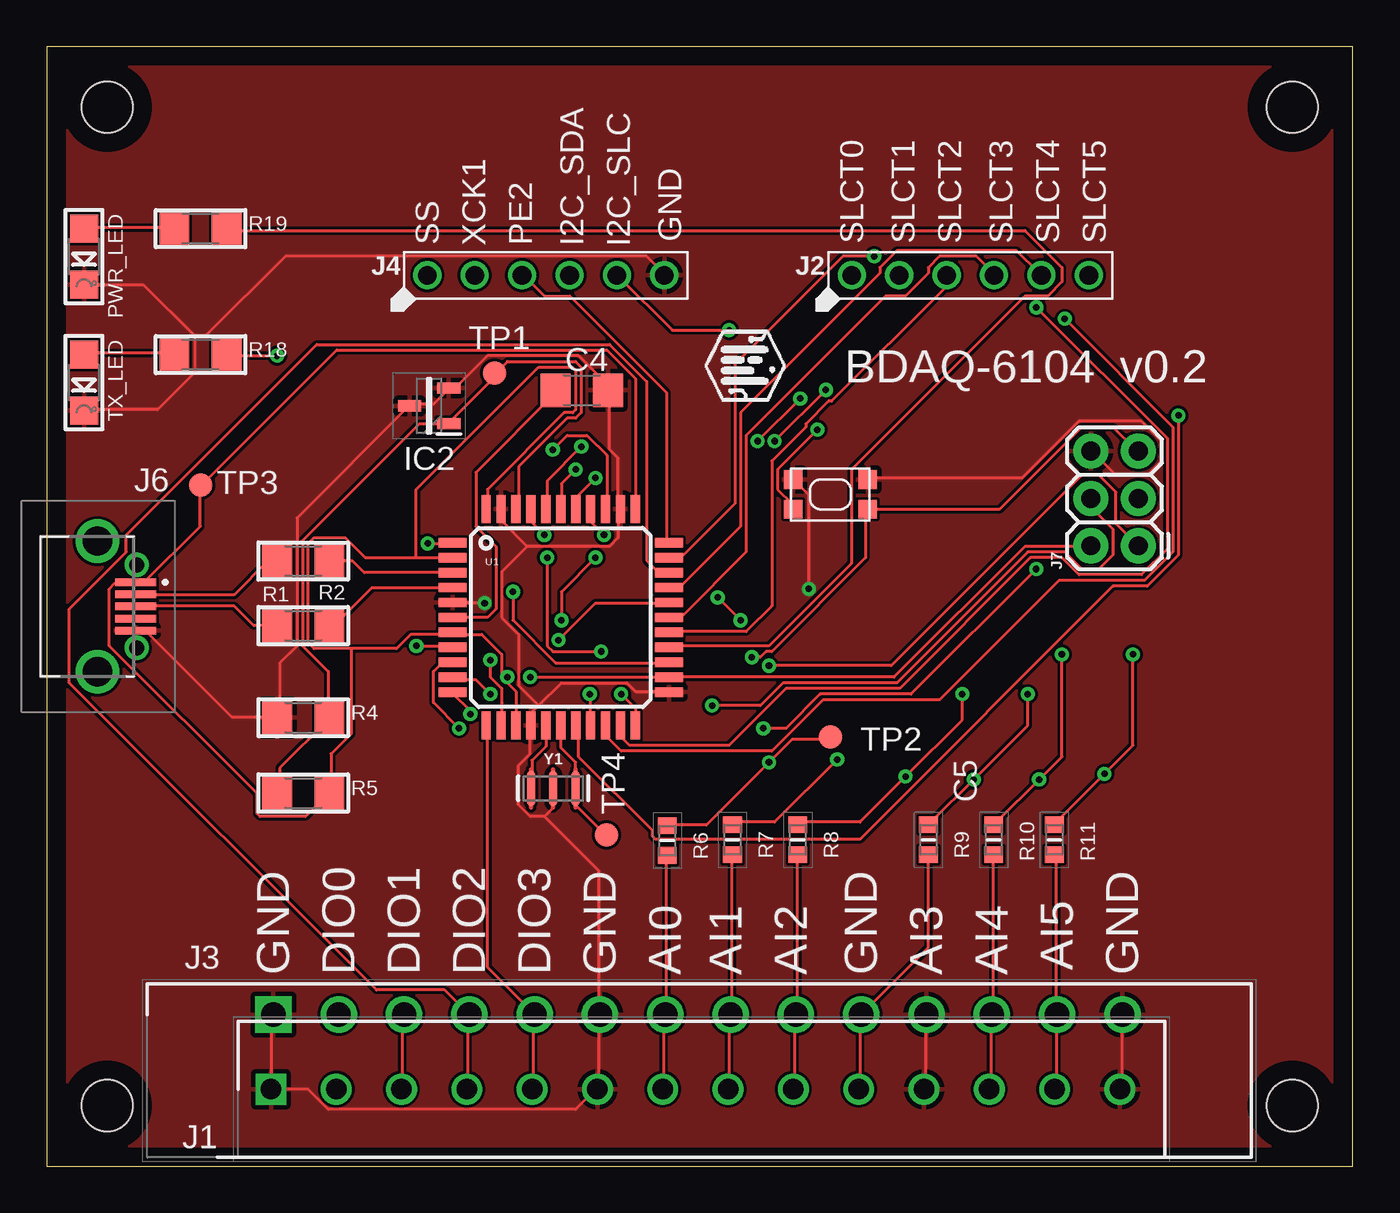
[diagram p1: board, top side]
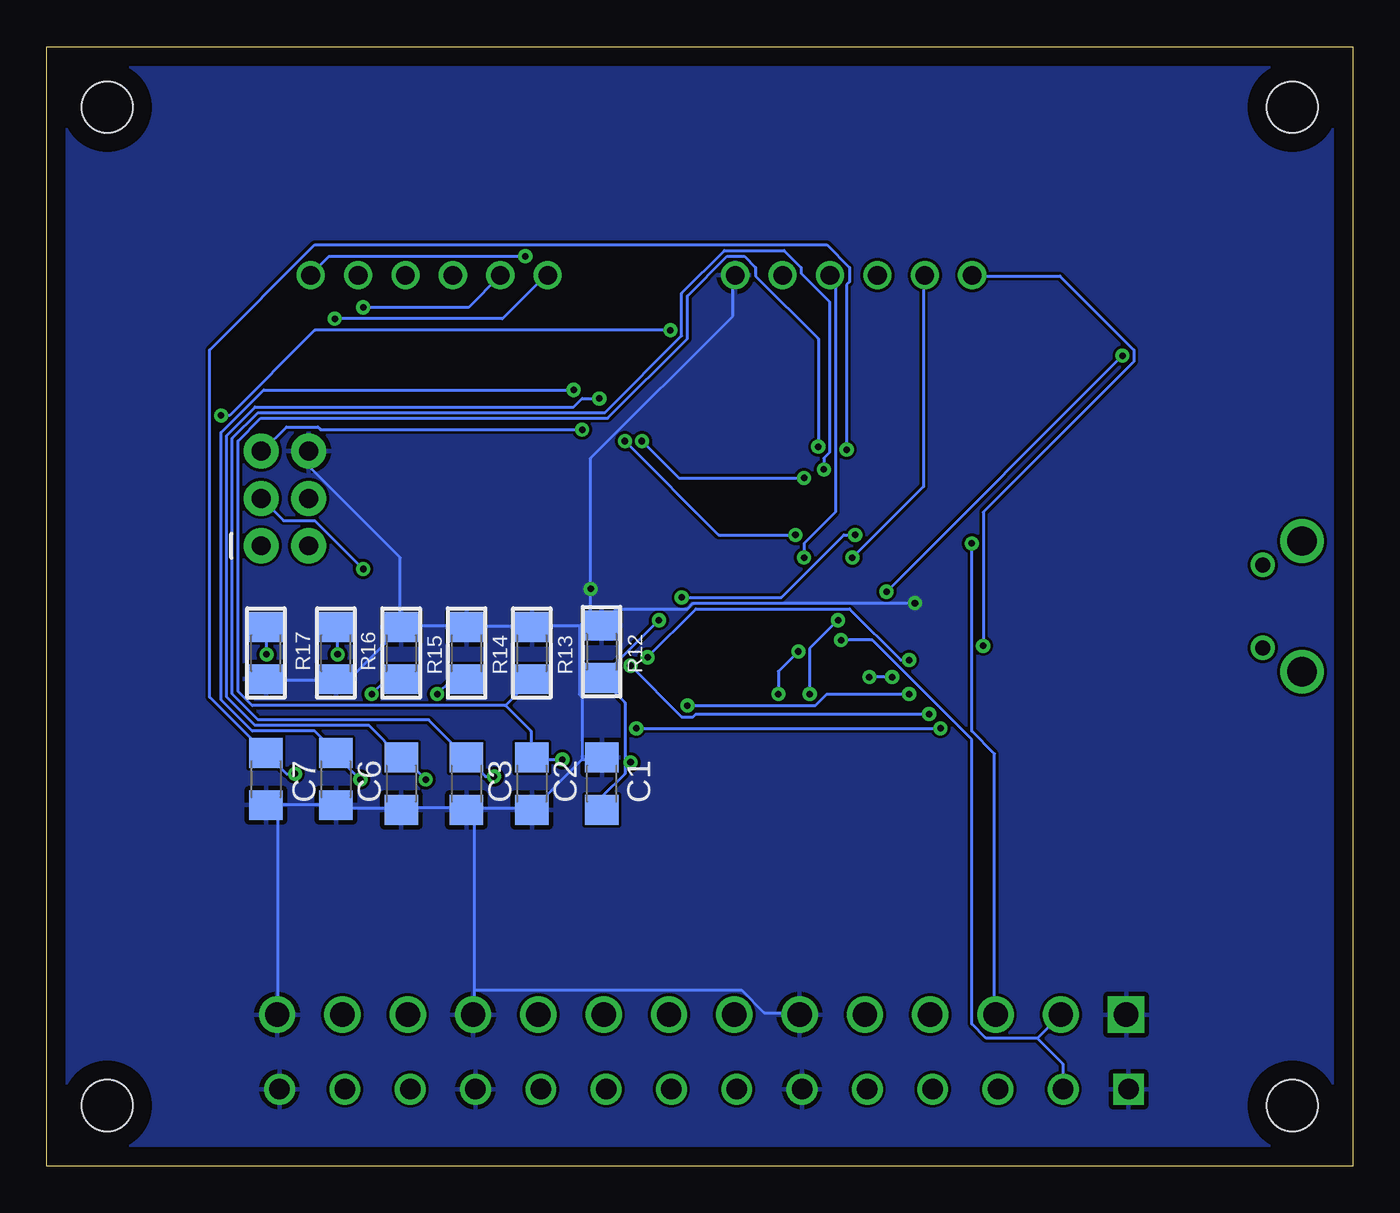
[diagram p2: board, bottom side, seen from below]

Size 70 x 60 mm. Coordinates in mm from the lower left corner, seen from the top.
Outline: 0,0 70,0 70,60 0,60 0,0
Copper layers (1*16): Top 0.035mm / dielectric 1.5mm / Bottom 0.035mm
Design rules "default": minimum track width 6mil, minimum drill 0.35mm, track to track 6mil, track to pad 6mil, pad to pad 6mil, via to via 6mil, smd to smd 6mil, copper to edge 40mil, drill to drill 6mil, minimum pad ring 10mil, minimum via ring 8mil, stop-mask expansion 4mil, vias tented up to drill 0mil, thermal gap 10mil
Holes 2.75 mm at 3.25,3.25 66.75,3.25 3.25,56.75 66.75,56.75

### Footprints (pad centres in the part's own frame; a part is rotated, then mirrored left to right if it is on the bottom)
C1206 = smd 1.6 x 1.8: 1 -1.4,0; 2 1.4,0
SOT95P237X112-3N = smd 1.25 x 0.6: 1 -1.05,0.95; 2 -1.05,-0.95; 3 1.05,0
RHDR16W90P0X350_1X14_5600X729X = drill 1.1 pad 1.65 square: 1 0,0 | drill 1.1 pad 1.65: 2 3.5,0; 3 7,0; 4 10.5,0; 5 14,0; 6 17.5,0; 7 21,0; 8 24.5,0; 9 28,0; 10 31.5,0; 11 35,0; 12 38.5,0; 13 42,0; 14 45.5,0
PTH_2.54MM_01X06 = drill 1: P$1 -6.35,0; P$2 -3.81,0; P$3 -1.27,0; P$4 1.27,0; P$5 3.81,0; P$6 6.35,0
393570014X350_1X14 = drill 1.3 pad 1.778 square: 1 0,0 | drill 1.3 pad 1.778: 2 3.5,0; 3 7,0; 4 10.5,0; 5 14,0; 6 17.5,0; 7 21,0; 8 24.5,0; 9 28,0; 10 31.5,0; 11 35,0; 12 38.5,0; 13 42,0; 14 45.5,0
UJ2MIBH24SMTTR = smd 2.2 x 0.4: 1 2.525,1.3; 2 2.525,0.65; 3 2.525,0; 4 2.525,-0.65; 5 2.525,-1.3 | drill 0.8 pad 1.2: MH1 2.575,2.225; MH2 2.575,-2.225 | drill 1.565 pad 2.348: MH3 0.475,-3.5; MH4 0.475,3.5
2X3 = drill 1.016 pad 1.88: 1 0,0; 2 0,2.54; 3 2.54,0; 4 2.54,2.54; 5 5.08,0; 6 5.08,2.54
CHIPLED_1206 = smd 1.5 x 1.5: A 0,-1.496; C 0,1.496
1206 = smd 1.6 x 1.8: 1 -1.4,0; 2 1.4,0
RESC1608X55N = smd 0.9 x 1: 1 -0.8,0; 2 0.8,0
KMR2 = smd 1 x 1: 1 2,0.8; 2 2,-0.8; 3 -2,0.8; 4 -2,-0.8
B1,27 = smd 1.27 x 1.27: TP 0,0
SPARKFUN-DIGITALIC_TQFP44 = smd 1.5 x 0.5: 1 -5.8,4; 2 -5.8,3.2; 3 -5.8,2.4; 4 -5.8,1.6; 5 -5.8,0.8; 6 -5.8,0; 7 -5.8,-0.8; 8 -5.8,-1.6; 9 -5.8,-2.4; 10 -5.8,-3.2; 11 -5.8,-4; 23 5.8,-4; 24 5.8,-3.2; 25 5.8,-2.4; 26 5.8,-1.6; 27 5.8,-0.8; 28 5.8,0; 29 5.8,0.8; 30 5.8,1.6; 31 5.8,2.4; 32 5.8,3.2; 33 5.8,4 | smd 0.5 x 1.5: 12 -4,-5.8; 13 -3.2,-5.8; 14 -2.4,-5.8; 15 -1.6,-5.8; 16 -0.8,-5.8; 17 0,-5.8; 18 0.8,-5.8; 19 1.6,-5.8; 20 2.4,-5.8; 21 3.2,-5.8; 22 4,-5.8; 34 4,5.8; 35 3.2,5.8; 36 2.4,5.8; 37 1.6,5.8; 38 0.8,5.8; 39 0,5.8; 40 -0.8,5.8; 41 -1.6,5.8; 42 -2.4,5.8; 43 -3.2,5.8; 44 -4,5.8
RESONATOR-SMD-3.2X1.3 = smd 0.45 x 1.905: 1 -1.2,0; 2 0,0; 3 1.2,0

### Placement (x,y rotation side)
C1  40.25,20.5 90 bottom
C2  44,20.5 270 bottom
C3  47.5,20.5 270 bottom
C4  28.68,41.59 0 top
C5  51,20.5 270 bottom
C6  54.5,20.75 270 bottom
C7  58.25,20.75 270 bottom
IC2  20.5,40.75 180 top
J1  12.02,4.12 0 top
J2  49.5,47.75 0 top
J3  12.15,8.12 0 top
J4  26.75,47.75 0 top
J6  2.25,30 0 top
J7  58.5,33.25 90 top
PWR_LED  2,48.75 180 top
R1  13.75,32.43 0 top
R2  13.75,28.97 0 top
R4  13.75,24.04 0 top
R5  13.75,20 0 top
R6  33.26,17.45 270 top
R7  36.75,17.5 270 top
R8  40.25,17.5 270 top
R9  47.25,17.5 270 top
R10  50.75,17.5 270 top
R11  54,17.5 270 top
R12  40.26,27.57 270 bottom
R13  44,27.5 270 bottom
R14  47.5,27.5 270 bottom
R15  51,27.5 270 bottom
R16  54.5,27.5 90 bottom
R17  58.25,27.5 90 bottom
R18  8.25,43.5 0 top
R19  8.25,50.25 0 top
SW1  42,36 180 top
TP1  24,42.5 0 top
TP2  42,23 0 top
TP3  8.25,36.5 0 top
TP4  30,17.75 0 top
TX_LED  2,42 180 top
U1  27.55,29.41 0 top
U$1  [LOGO_TOP]  35.25,41 0 top
Y1  27.15,20.25 0 top

### Tracks (layer width: path | path; a pad name or v marks a point on that pad's centre or on a via)
AI0  (via drill 0.35)
  Top 0.152: R6.1 33.38,18.29 35.36,18.29 v38.71,21.64 39.93,22.86 41.91,22.86 TP2.TP | v26.67,33.83 26.06,34.44 26.06,35.2 U1.41 | v37.19,29.26 v35.97,30.48
  Bottom 0.152: v26.67,33.83 27.28,33.83 30.63,30.48 v35.97,30.48 | v37.19,29.26 40.23,26.21 R12.2 40.23,26.06 39.01,24.84 39.01,21.64 | 39.01,21.64 39.01,21.03 40.23,19.81 40.23,19.2 C1.1 | 39.01,21.64 v38.71,21.64
AI0_IN
  Top 0.152: R6.2 33.22,16.61 33.22,8.23 J3.7 33.07,8.08 33.07,4.27 J1.7
AI1  (via drill 0.35)
  Top 0.152: v42.37,21.79 39.01,18.44 36.88,18.44 R7.1 | v28.65,38.56 26.82,36.73 26.82,35.36 U1.40
  Bottom 0.152: v42.37,21.79 43.89,21.79 C2.1 44.04,21.95 44.04,23.32 45.41,24.69 | v28.65,38.56 28.65,44.35 32,47.7 32,48.16 32.61,48.77 33.53,48.77 35.66,46.63 35.66,44.35 39.93,40.08 58.52,40.08 59.74,38.86 59.74,25.45 58.98,24.69 45.41,24.69 | 45.41,24.69 44.04,26.06 R13.2
AI1_IN
  Top 0.152: R7.2 36.73,16.61 36.73,8.23 J3.8 36.58,8.08 36.58,4.27 J1.8
AI2  (via drill 0.35)
  Top 0.152: R8.1 40.39,18.44 43.59,18.44 v46.02,20.88 49.07,23.93 v49.07,25.3 | v28.35,37.34 27.58,36.58 27.58,35.36 U1.39
  Bottom 0.152: v46.02,20.88 46.48,20.88 47.4,21.79 C3.1 47.55,21.95 49.53,23.93 58.67,23.93 60.05,25.3 60.05,39.01 58.67,40.39 40.08,40.39 35.97,44.5 35.97,46.79 33.68,49.07 30.48,49.07 29.57,48.16 29.57,47.85 28.04,46.33 28.04,38.25 28.35,37.95 v28.35,37.34 | v49.07,25.3 48.31,26.06 47.55,26.06 R14.2
AI2_IN
  Top 0.152: R8.2 40.23,16.61 40.23,8.23 J3.9 40.08,8.08 40.08,4.27 J1.9
AI3  (via drill 0.35)
  Top 0.152: R9.1 47.4,18.44 v49.68,20.73 52.58,23.62 v52.58,25.3 | v29.41,36.88 28.5,35.97 28.5,35.36 U1.38 | v40.39,41.15 v38.1,38.86
  Bottom 0.152: v49.68,20.73 50.9,21.95 C5.1 51.05,21.95 52.73,23.62 58.83,23.62 60.35,25.15 60.35,39.17 58.83,40.69 41.76,40.69 41.3,41.15 v40.39,41.15 | v29.41,36.88 36.12,36.88 v38.1,38.86 | v52.58,25.3 51.82,26.06 51.05,26.06 R15.2
AI3_IN
  Top 0.152: R9.2 47.24,16.61 47.24,11.73 43.74,8.23 J3.10 43.59,8.08 43.59,4.27 J1.10
AI4  (via drill 0.35)
  Top 0.152: R10.1 50.9,18.44 v53.19,20.73 54.41,21.95 v54.41,27.43 | v29.87,33.83 29.26,34.44 29.26,35.2 U1.37 | v41.76,41.6 v39.01,38.86
  Bottom 0.152: v53.19,20.73 54.56,22.1 C6.1 54.56,22.25 55.63,23.32 58.98,23.32 60.66,24.99 60.66,39.32 58.37,41.6 v41.76,41.6 | v29.87,33.83 33.98,33.83 v39.01,38.86 | v54.41,27.43 54.41,28.8 R16.2
AI4_IN
  Top 0.152: R10.2 50.75,16.61 50.75,8.23 J3.12 50.6,8.08 50.6,4.27 J1.12
AI5  (via drill 0.35)
  Top 0.152: R11.1 54.1,18.44 v56.69,21.03 58.22,22.55 v58.22,27.43 | v27.13,38.41 27.89,39.17 28.96,39.17 30.02,38.1 30.02,35.36 U1.36
  Bottom 0.152: v56.69,21.03 57.15,21.03 58.22,22.1 C7.1 58.37,22.25 61.27,25.15 61.27,43.74 55.63,49.38 28.19,49.38 26.98,48.16 26.98,47.4 27.13,47.24 v27.13,38.41 | v58.22,27.43 58.22,28.8 R17.2
AI5_IN
  Top 0.152: R11.2 54.1,16.61 54.1,8.23 J3.13 54.1,8.08 54.1,4.27 J1.13
AREF
  Top 0.152: R5.1 12.5,20.12 12.5,21.34 15.09,23.93 R4.2 15.09,24.08 15.09,26.52 13.72,27.89 13.72,33.53 19.96,39.78 21.49,39.78 IC2.1 21.64,39.93 24.08,42.37 TP1.TP 24.08,42.52 24.69,43.13 28.35,43.13 28.65,42.82 28.65,40.39 28.35,40.08 27.89,40.08 25.3,37.49 25.3,35.36 U1.42
D+
  Top 0.152: U1.4 17.44,31.01 15.4,28.97 15.39,28.96 15.24,28.96 R2.2
D-
  Top 0.152: U1.3 17.02,31.81 16.4,32.43 R1.2
DIO0  (via drill 0.35)
  Top 0.152: v27.43,28.19 29.41,30.18 33.22,30.18 U1.29
  Bottom 0.152: v27.43,28.19 25.76,28.19 20.42,22.86 20.42,7.62 19.66,6.86 16.92,6.86 | 16.92,6.86 15.7,8.08 J3.2 | 16.92,6.86 15.54,5.49 15.54,4.27 J1.2
DIO1  (via drill 0.35)
  Top 0.152: v20.42,33.38 21.64,33.38 U1.1 | J1.3 19.05,4.27 19.05,8.08 J3.3
  Bottom 0.152: v20.42,33.38 20.42,23.32 19.2,22.1 19.2,8.23 J3.3
DIO2
  Top 0.152: U1.31 33.22,31.85 32.77,31.85 32.16,32.46 32.16,42.06 30.18,44.04 14.48,44.04 4.27,33.83 4.27,32.92 1.22,29.87 1.22,25.91 17.68,9.45 21.34,9.45 22.55,8.23 J3.4 22.55,8.08 22.55,4.27 J1.4
DIO3
  Top 0.152: U1.12 23.62,23.47 23.62,10.67 26.06,8.23 J3.5 26.06,8.08 26.06,4.27 J1.5
GND  (via drill 0.35)
  Top 0.152: J3.1 12.04,8.08 12.04,4.27 J1.1 12.04,4.12 14.02,4.12 15.09,3.05 28.35,3.05 29.41,4.12 J1.6 29.57,4.27 29.57,8.08 J3.6 29.57,8.23 29.57,15.85 26.67,18.75 | J6.5 4.88,28.8 5.18,28.8 9.91,24.08 12.34,24.08 R4.1 12.5,24.08 12.5,26.98 13.41,27.89 13.41,34.75 19.36,40.69 IC2.3 19.51,40.84 20.73,40.84 21.49,41.6 IC2.2 21.64,41.76 21.95,41.76 23.62,43.43 28.5,43.43 30.02,41.91 30.02,41.6 C4.2 30.18,41.45 30.18,38.41 30.63,37.95 30.63,35.36 U1.35 30.63,35.2 30.63,33.68 30.18,33.22 25.76,33.22 | 26.67,18.75 25.91,18.75 25.3,19.36 25.3,21.49 25.91,22.1 25.91,23.47 U1.15 26.06,23.62 26.06,24.38 26.36,24.69 | 26.67,18.75 27.13,19.2 | 27.13,19.2 27.15,19.23 | 26.36,24.69 27.58,25.91 31.09,25.91 31.55,25.45 33.22,25.45 U1.23 | 25.76,33.22 24.38,34.59 24.38,35.2 U1.43 | 26.36,24.69 25.3,25.76 25.3,28.5 24.38,29.41 24.38,31.85 25.76,33.22 | J1.14 57.61,4.27 57.61,8.08 J3.14 | J1.11 47.09,4.27 47.09,8.08 J3.11 | SW1.4 44.04,36.88 52.27,36.88 55.32,39.93 58.67,39.93 59.74,38.86 59.74,37.8 58.98,37.03 57.3,37.03 56.08,38.25 J7.6 | 7.92,44.5 7.92,42.52 5.94,40.54 2.13,40.54 TX_LED.C | 7.92,44.5 5.18,47.24 2.13,47.24 PWR_LED.C | v40.84,30.94 40.84,35.97 40.08,36.73 SW1.2 | v23.47,30.18 21.79,30.18 U1.5 | 7.92,44.5 8.53,44.5 12.8,48.77 32.16,48.77 33.07,47.85 J4.P$6 | 27.13,19.2 27.15,19.23 Y1.2
  Bottom 0.152: 57.61,19.36 54.56,19.36 C6.2 54.41,19.2 51.05,19.2 C5.2 50.9,19.2 47.55,19.2 C3.2 | 57.61,19.36 58.22,19.36 C7.2 57.61,19.36 | 47.09,19.2 47.4,19.2 C3.2 | 47.09,19.2 44.04,19.2 C2.2 43.89,19.2 41.3,21.79 | 41.3,21.79 40.39,21.79 C1.2 | 47.09,19.2 47.09,9.45 | 47.09,9.45 47.09,8.23 J3.11 | 47.09,19.2 C3.2 | 57.61,19.36 57.61,8.23 J3.14 | R17.1 58.22,26.06 54.56,26.06 R16.1 54.41,26.21 53.65,26.21 51.05,28.8 R15.1 | R15.1 50.9,28.96 47.55,28.96 R14.1 47.4,28.96 44.04,28.96 R13.1 43.89,28.96 41.45,28.96 | J7.6 55.93,38.25 55.93,37.49 51.05,32.61 51.05,28.96 R15.1 | 40.84,29.57 v40.84,30.94 40.84,37.95 33.22,45.57 33.22,47.7 J4.P$6 | 40.84,29.57 40.39,29.11 R12.1 | v23.47,30.18 35.36,30.18 35.66,29.87 39.47,29.87 40.23,29.11 R12.1 | 40.84,29.57 41.45,28.96 | 40.84,29.57 R12.1 | 41.3,21.79 41.3,25.15 41.45,25.3 41.45,28.96 | 47.09,9.45 32.77,9.45 31.55,8.23 29.72,8.23 J3.6
  pour Top: 0,0 0,60 70,60 70,0
  pour Bottom: 0,0 0,60 70,60 70,0
I2C_SDA  (via drill 0.35)
  Top 0.152: v29.11,25.3 29.11,23.62 U1.19 | v27.58,29.26 27.58,30.79 v29.41,32.61
  Bottom 0.152: v29.11,25.3 29.11,27.74 v27.58,29.26 | v29.41,32.61 29.41,33.38 27.74,35.05 27.74,47.55 27.89,47.7 J4.P$4
I2C_SLC  (via drill 0.35)
  Top 0.152: v60.66,40.23 60.66,32.77 58.98,31.09 57.15,31.09 43.59,17.53 32.61,17.53 32.46,17.68 32.46,17.98 28.5,21.95 28.5,23.47 U1.18 | v36.58,44.81 33.53,44.81 30.63,47.7 J4.P$5
  Bottom 0.152: v60.66,40.23 60.2,40.23 55.63,44.81 v36.58,44.81
MISO  (via drill 0.35)
  Top 0.152: v22.71,24.23 22.71,24.38 21.79,25.3 U1.11 | v38.71,26.82 45.26,26.82 55.47,37.03 56.39,37.03 57.3,36.12 57.3,34.44 58.37,33.38 J7.1
  Bottom 0.152: v22.71,24.23 35.2,24.23 35.36,24.08 35.97,24.08 v38.71,26.82
MOSI  (via drill 0.35)
  Top 0.152: v23.77,25.3 23.01,26.06 21.79,26.06 U1.10 | v35.66,24.69 38.25,24.69 39.47,25.91 45.57,25.91 52.58,32.92 54.56,32.92 55.47,32 56.39,32 57.15,32.77 57.15,34.14 56.08,35.2 56.08,35.66 J7.4
  Bottom 0.152: v23.77,25.3 28.19,25.3 28.8,24.69 v35.66,24.69
N$2
  Top 0.152: 4.72,30.62 4.88,30.62 10.04,30.62 11.85,32.43 11.89,32.46 12.34,32.46 R1.1 | 4.72,30.62 4.58,30.62 | 4.72,30.62 4.72,30.63 J6.2
N$5
  Top 0.152: 4.88,30.03 10.04,30.03 11.1,28.97 R2.1 | 4.88,30.03 4.58,30.03 | J6.3 4.88,30.02 4.88,30.03
N$7
  Top 0.152: U1.6 21.79,29.41 23.62,29.41 24.08,29.87 24.08,33.22 23.01,34.29 23.01,37.19 27.28,41.45 C4.1
N$8
  Top 0.152: TX_LED.A 2.13,43.59 6.71,43.59 R18.1
N$9
  Top 0.152: PWR_LED.A 2.13,50.29 6.71,50.29 R19.1
PE2
  Top 0.152: U1.33 33.22,33.53 33.22,41.45 28.04,46.63 26.67,46.63 25.6,47.7 J4.P$3
PWR_LED
  Top 0.152: U1.26 33.38,27.89 38.71,27.89 43.13,32.31 43.13,37.34 52.43,46.63 53.65,46.63 54.41,47.4 54.41,48.16 52.43,50.14 9.75,50.14 R19.2
RESET  (via drill 0.35)
  Top 0.152: v41.3,39.47 39.17,37.34 39.17,36.27 39.93,35.51 39.93,35.2 SW1.1 | J7.5 58.37,38.41 57.15,39.62 55.47,39.62 51.05,35.2 44.04,35.2 SW1.3 43.89,35.05 43.89,32.61 38.86,27.58 38.56,27.58 38.25,27.28 v37.8,27.28 | v23.77,27.13 23.77,26.21 24.38,25.6 24.38,23.62 U1.13
  Bottom 0.152: v41.3,39.47 55.32,39.47 55.47,39.62 57.15,39.62 58.37,38.41 J7.5 | v23.77,27.13 24.23,27.13 26.98,29.87 35.2,29.87 v37.8,27.28
SCK  (via drill 0.35)
  Top 0.152: v22.1,23.47 20.73,24.84 20.73,26.52 21.18,26.98 21.64,26.98 U1.9 | v38.41,23.47 39.62,23.47 41.45,25.3 46.33,25.3 v53.03,32
  Bottom 0.152: v38.41,23.47 v22.1,23.47 | v53.03,32 55.63,34.59 57.3,34.59 58.37,35.66 J7.3
SLCT0  (via drill 0.35)
  Top 0.152: v54.56,45.41 60.35,39.62 60.35,32.92 58.83,31.39 54.25,31.39 47.85,24.99 41.6,24.99 38.86,22.25 30.79,22.25 30.02,23.01 30.02,23.47 U1.20
  Bottom 0.152: v54.56,45.41 45.57,45.41 43.28,47.7 J2.P$1
SLCT1  (via drill 0.35)
  Top 0.152: v53.03,46.02 60.05,39.01 60.05,33.07 58.67,31.7 55.32,31.7 54.41,32.61 52.73,32.61 45.72,25.6 39.62,25.6 36.58,22.55 31.24,22.55 30.79,23.01 30.79,23.47 U1.21
  Bottom 0.152: v53.03,46.02 47.4,46.02 45.72,47.7 J2.P$2
SLCT2
  Top 0.152: U1.27 33.38,28.65 37.49,28.65 38.86,30.02 38.86,37.8 40.69,39.62 40.69,39.78 41.91,41 42.06,41 48.16,47.09 48.16,47.7 J2.P$3
SLCT3
  Top 0.152: U1.28 33.38,29.41 33.98,29.41 37.49,32.92 37.49,39.17 44.96,46.63 46.02,46.63 47.24,47.85 47.24,48.16 47.85,48.77 49.84,48.77 50.75,47.85 J2.P$4
SLCT4
  Top 0.152: U1.30 33.38,31.09 33.98,31.09 37.19,34.29 37.19,40.39 44.65,47.85 44.65,48.16 45.57,49.07 51.97,49.07 53.19,47.85 J2.P$5
SLCT5  (via drill 0.35)
  Top 0.152: v44.35,48.77 42.67,48.77 36.88,42.98 36.88,35.51 33.98,32.61 33.38,32.61 U1.32
  Bottom 0.152: v44.35,48.77 54.86,48.77 55.78,47.85 J2.P$6
SS  (via drill 0.35)
  Top 0.152: v19.81,27.89 21.64,27.89 U1.8
  Bottom 0.152: v19.81,27.89 19.81,35.05 11.73,43.13 11.73,43.74 15.7,47.7 20.27,47.7 J4.P$1
TX_LED  (via drill 0.35)
  Top 0.152: v24.99,30.79 24.99,29.26 27.28,26.98 33.22,26.98 U1.25 | v12.34,43.43 9.75,43.43 R18.2
  Bottom 0.152: v12.34,43.43 v24.99,30.79
V_USB  (via drill 0.35)
  Top 0.152: U1.34 31.55,35.36 31.55,42.22 30.02,43.74 15.54,43.74 8.38,36.58 TP3.TP 8.23,36.42 8.23,34.29 5.18,31.24 4.88,31.24 J6.1 4.72,31.24 3.66,31.24 3.35,30.94 3.35,27.89 11.28,19.96 11.28,18.9 11.43,18.75 13.87,18.75 15.09,19.96 R5.2 15.24,20.12 15.24,22.1 16.31,23.16 16.31,27.74 | J7.2 55.93,33.22 52.43,33.22 45.41,26.21 33.38,26.21 U1.24 33.22,26.21 v25.91,26.21 | 24.54,26.06 24.38,26.21 24.38,27.43 23.32,28.5 21.79,28.5 U1.7 21.64,28.5 19.51,28.5 18.75,27.74 16.31,27.74 | 24.54,26.06 25.15,25.45 25.15,23.62 U1.14 | 19.81,32.61 17.07,32.61 16,33.68 14.33,33.68 14.02,33.38 14.02,28.04 14.33,27.74 16.31,27.74 | 19.81,32.61 21.64,32.61 U1.2 | 19.81,32.61 19.81,36.27 26.36,42.82 28.19,42.82 28.35,42.67 28.35,40.54 28.19,40.39 27.74,40.39 23.62,36.27 23.62,35.36 U1.44 | 24.54,26.06 v24.69,26.21
  Bottom 0.152: v24.69,26.21 v25.91,26.21
XCK1  (via drill 0.35)
  Top 0.152: v30.79,25.3 31.55,24.54 31.55,23.62 U1.22 | v29.72,27.58 27.13,27.58 26.82,27.89 v26.82,32.61
  Bottom 0.152: v30.79,25.3 30.79,26.52 v29.72,27.58 | v26.82,32.61 23.01,36.42 23.01,47.7 J4.P$2
XTAL1
  Top 0.152: U1.17 27.55,22.45 28.35,21.65 Y1.3 28.35,19.36 29.87,17.83 TP4.TP
XTAL2
  Top 0.152: U1.16 26.75,22.5 26,21.75 26,20.73 | 26,20.73 26,20.35 | Y1.1 26.06,20.73 26,20.73

### Text on the board
tNames: I2C_SDA | I2C_SLC | SLCT0 | SLCT1 | SLCT2 | SLCT3 | SLCT4 | SLCT5 | XCK1 | GND | PE2 | SS | BDAQ-6104 | v0.2 | GND | DIO0 | DIO1 | DIO2 | DIO3 | GND | AI0 | AI1 | AI2 | GND | AI3 | AI4 | AI5 | GND